# EAGLE design Inverter_DC_current_sensors_v1 (EAGLE 6.6.0)
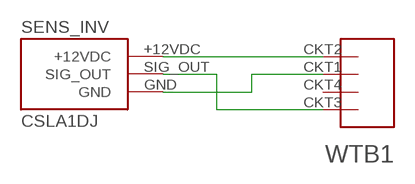
[diagram p0: schematic, sheet 1]

## Parts
SENS_INV  CSLA1DJ  [CSLA1DJ]
WTB1  MHYBRIDMOLEX  [MOLEXMINIFIT6]

## Nets
N$1: SENS_INV.+12VDC WTB1.CKT2(GND2)
N$2: SENS_INV.GND WTB1.CKT1(GND)
N$3: SENS_INV.SIG_OUT WTB1.CKT3(V_IN(12))
Unconnected: WTB1.CKT4(V_IN2(12))

## Library data of the parts
SENS_INV = MHR15-TS:CSLA1DJ
WTB1 = mhybrid molex megaFit:MHYBRIDMOLEX

## Board
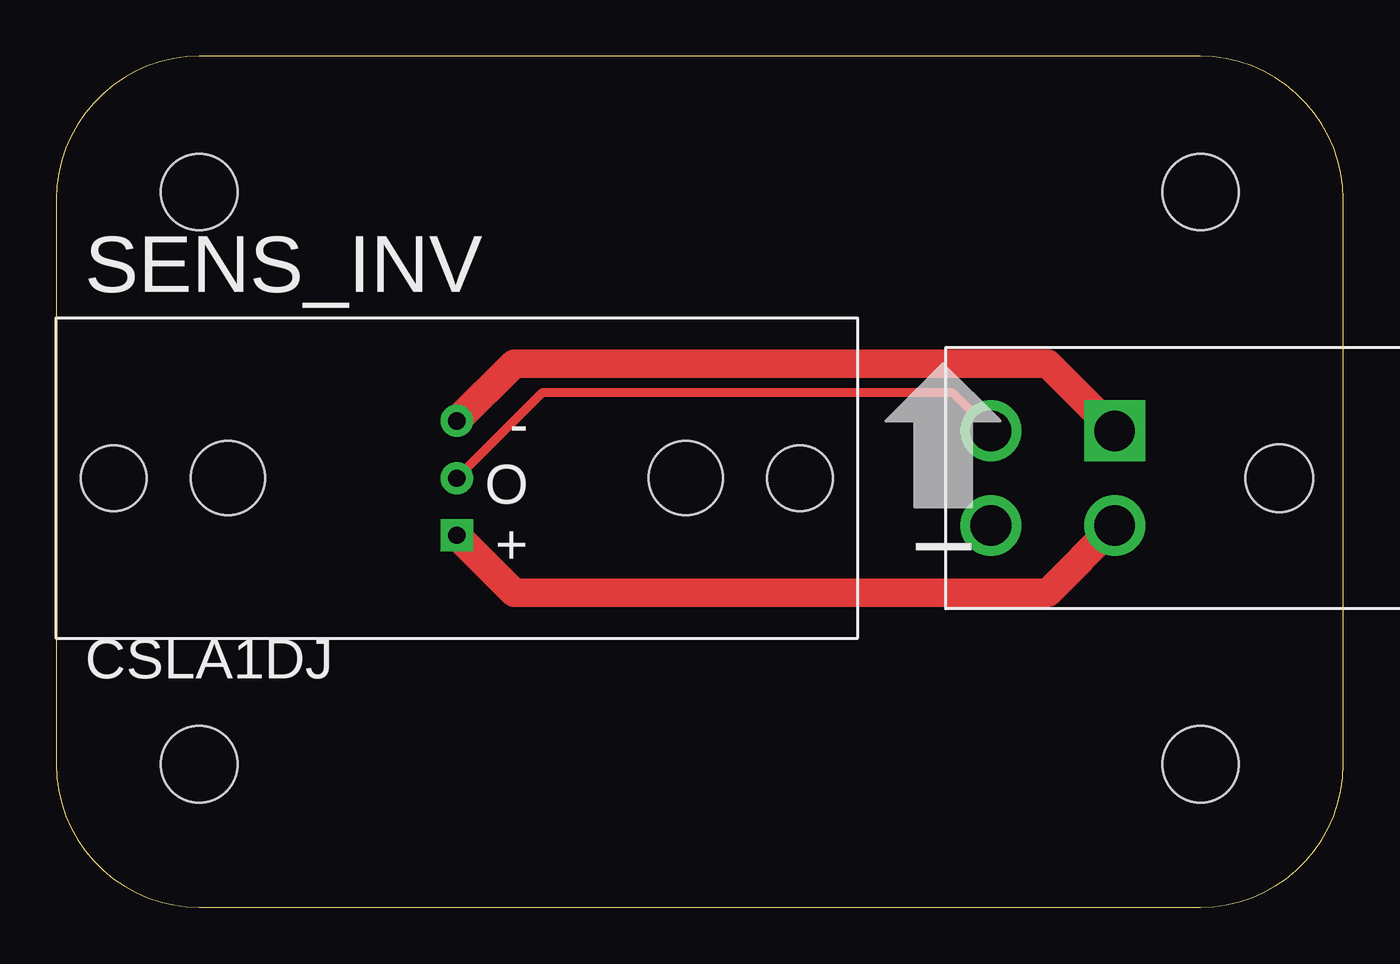
[diagram p1: board, top side]

Size 57.13 x 37.77 mm. Coordinates in mm from the lower left corner, seen from the top.
Outline: 0,31.42 0,6.35 arc90 6.35,0 50.78,0 arc90 57.13,6.35 57.13,31.42 arc90 50.78,37.77 6.35,37.77 arc90 0,31.42
Copper layers (1*16): Top 0.0356mm / dielectric 1.5011mm / Bottom 0.0356mm
Design rules "LaenPCBOrder": minimum track width 6mil, minimum drill 13mil, track to track 6mil, track to pad 6mil, pad to pad 6mil, via to via 6mil, smd to smd 6mil, copper to edge 15mil, drill to drill 6mil, minimum pad ring 7mil, minimum via ring 7mil, stop-mask expansion 3mil, vias tented up to drill 0mil, thermal gap 10mil
Holes 3.4 mm at 6.35,6.35 50.8,6.35 6.35,31.75 50.8,31.75

### Footprints (pad centres in the part's own frame; a part is rotated, then mirrored left to right if it is on the bottom)
CSLA1DJ = drill 0.762 pad 1.422 square: +12VDC 0,-2.54 | drill 0.762 pad 1.422: GND 0,2.54; SIG_OUT 0,0 | hole 2.921: -15.24,0; 15.24,0 | hole 3.302: -10.16,0; 10.16,0
MOLEXMINIFIT6 = drill 1.8 square: CKT1 2.1,0 | drill 1.8: CKT2 -2.1,0; CKT3 2.1,5.5; CKT4 -2.1,5.5 | hole 3: 0,-7.3

### Placement (x,y rotation side)
SENS_INV  17.78,19.05 0 top
WTB1  46.99,19.05 90 top

### Tracks (layer width: path | path; a pad name or v marks a point on that pad's centre or on a via)
N$1
  Top 1.27: SENS_INV.+12VDC 20.32,13.97 44.01,13.97 WTB1.CKT2
N$2
  Top 1.27: SENS_INV.GND 20.32,24.13 44.01,24.13 WTB1.CKT1
N$3
  Top 0.406: SENS_INV.SIG_OUT 21.59,22.86 39.78,22.86 WTB1.CKT3

### Text on the board
bNames: MHR-15 / Inverter DC Current Sense Board v1 / Carl Steinhauser, Ben Wang / 2/24/15